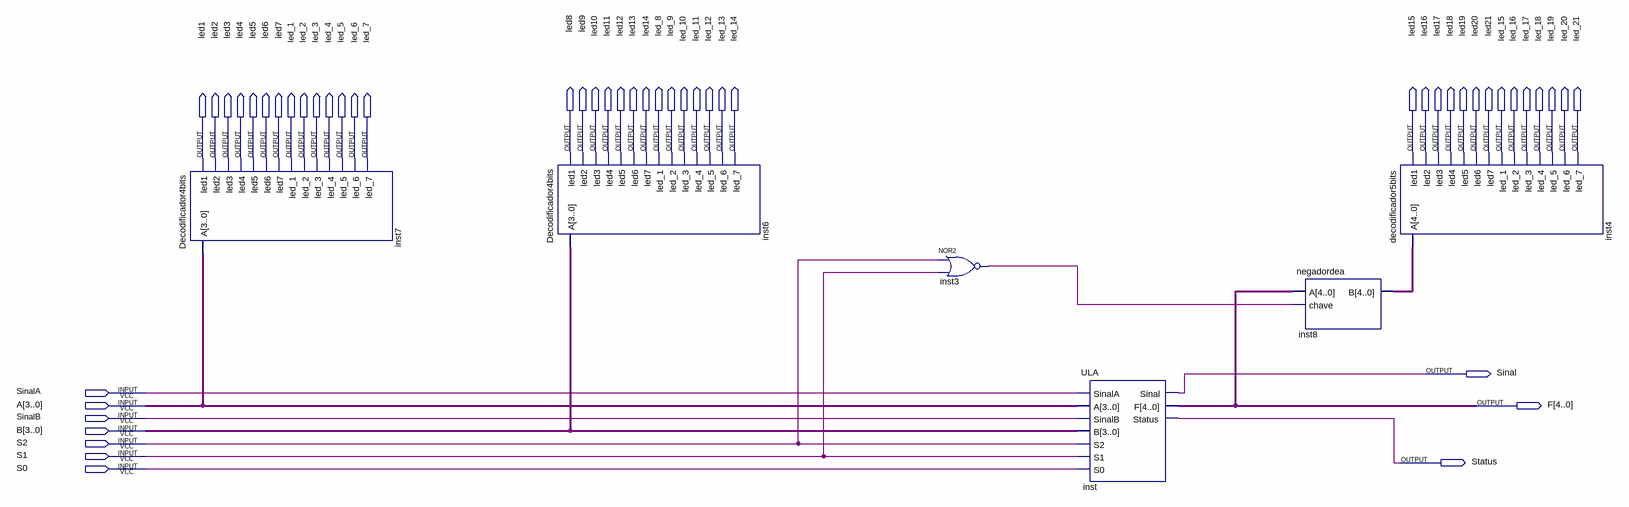
[diagram p0: schematic sheet]
// Quartus schematic projeto.bdf as structural Verilog: 6 symbols, 52 pins
module projeto (
  input  SinalA,
  input  [3:0] A,
  input  SinalB,
  input  [3:0] B,
  input  S2,
  input  S1,
  input  S0,
  output led8,
  output led9,
  output led10,
  output led11,
  output led12,
  output led13,
  output led14,
  output led_8,
  output led_9,
  output led_10,
  output led_11,
  output led_12,
  output led_13,
  output led_14,
  output led15,
  output led16,
  output led17,
  output led18,
  output led19,
  output led20,
  output led21,
  output led_15,
  output led_16,
  output led_17,
  output led_18,
  output led_19,
  output led_20,
  output led_21,
  output led1,
  output led2,
  output led3,
  output led4,
  output led5,
  output led6,
  output led7,
  output led_1,
  output led_2,
  output led_3,
  output led_4,
  output led_5,
  output led_6,
  output led_7,
  output Sinal,
  output [4:0] F,
  output Status
);

  wire inst3_out;
  wire [4:0] inst8_b;

  Decodificador4bits inst7 (
    .A(A), .led1(led1), .led2(led2), .led3(led3), .led4(led4), .led5(led5), .led6(led6), .led7(led7),
    .led_1(led_1), .led_2(led_2), .led_3(led_3), .led_4(led_4), .led_5(led_5), .led_6(led_6), .led_7(led_7));
  Decodificador4bits inst6 (
    .A(B), .led1(led8), .led2(led9), .led3(led10), .led4(led11), .led5(led12), .led6(led13), .led7(led14),
    .led_1(led_8), .led_2(led_9), .led_3(led_10), .led_4(led_11), .led_5(led_12), .led_6(led_13),
    .led_7(led_14));
  nor inst3 (inst3_out, S2, S1);
  ULA inst (
    .SinalA(SinalA), .A(A), .SinalB(SinalB), .B(B), .S2(S2), .S1(S1), .S0(S0), .Sinal(Sinal), .F(F),
    .Status(Status));
  negadordea inst8 (.A(F), .chave(inst3_out), .B(inst8_b));
  decodificador5bits inst4 (
    .A(inst8_b), .led1(led15), .led2(led16), .led3(led17), .led4(led18), .led5(led19), .led6(led20),
    .led7(led21), .led_1(led_15), .led_2(led_16), .led_3(led_17), .led_4(led_18), .led_5(led_19),
    .led_6(led_20), .led_7(led_21));
endmodule
